# Altium schematic sheet Buffer.SchDoc: fNIRS - Buffer
size A4; CompanyName: UofT Capstone Team 2024991; Revision: 1; SheetNumber: 10; SheetTotal: 13
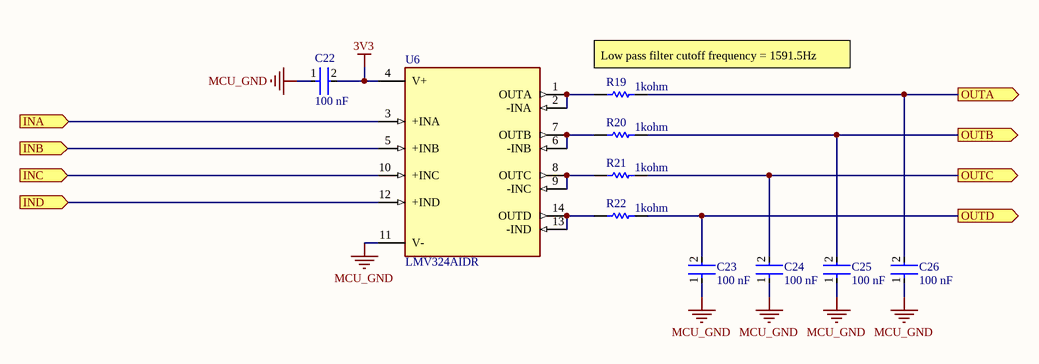
[diagram p0: Buffer.SchDoc]

## Parts
C22  Capacitance: 100 nF  [FP-CC0603-DA-MFG]  (hidden comment: CC0603KRX7R7BB104)
C23  Capacitance: 100 nF  [FP-CC0603-DA-MFG]  (hidden comment: CC0603KRX7R7BB104)
C24  Capacitance: 100 nF  [FP-CC0603-DA-MFG]  (hidden comment: CC0603KRX7R7BB104)
C25  Capacitance: 100 nF  [FP-CC0603-DA-MFG]  (hidden comment: CC0603KRX7R7BB104)
C26  Capacitance: 100 nF  [FP-CC0603-DA-MFG]  (hidden comment: CC0603KRX7R7BB104)
R19  Resistance: 1kohm  [RESC1608X55X25ML10T15]  (hidden comment: RC0603JR-071KL)
R20  Resistance: 1kohm  [RESC1608X55X25ML10T15]  (hidden comment: RC0603JR-071KL)
R21  Resistance: 1kohm  [RESC1608X55X25ML10T15]  (hidden comment: RC0603JR-071KL)
R22  Resistance: 1kohm  [RESC1608X55X25ML10T15]  (hidden comment: RC0603JR-071KL)
U6  LMV324AIDR  [SOIC127P600X175-14N]

## Ports
INA (in, see Sensing[6B]), INB (in, see Sensing[6B]), INC (in, see Sensing[6B]), IND (in, see Sensing[6B]), OUTA (out, see Sensing[6B]), OUTB (out, see Sensing[6B]), OUTC (out, see Sensing[6B]), OUTD (out, see Sensing[6B])

## Nets
3V3: C22.2 U6.4(V+)
MCU_GND: C22.1 C23.1 C24.1 C25.1 C26.1 U6.11(V-)
INA: U6.3(+INA) ; port INA
INB: U6.5(+INB) ; port INB
INC: U6.10(+INC) ; port INC
IND: U6.12(+IND) ; port IND
OUTA: C26.2 R19.2 ; port OUTA
OUTB: C25.2 R20.2 ; port OUTB
OUTC: C24.2 R21.2 ; port OUTC
OUTD: C23.2 R22.2 ; port OUTD
NetR19_1: R19.1 U6.1(OUTA) U6.2(-INA)
NetR20_1: R20.1 U6.6(-INB) U6.7(OUTB)
NetR21_1: R21.1 U6.8(OUTC) U6.9(-INC)
NetR22_1: R22.1 U6.13(-IND) U6.14(OUTD)

## Notes on the sheet
- (near R19) Low pass filter cutoff frequency = 1591.5Hz

## Library data of the parts
C22-C26 = CMP-2000-05002-2: CAP CER 0.1UF 16V X7R 0603; Manufacturer: YAGEO; Tolerance: 0.1; Value: 100 nF; Temperature Coefficient: 15%; Material: Ceramic; Voltage Rating: 16 V; Package: CC0603-DA; ComponentLink2Description: Datasheet; Octopart: https://octopart.com/cc0603krx7r7bb104-yageo-192941; Temperature Range High: +125°C; Digikey Description: CAP CER 0.1UF 16V X7R 0603; Voltage: 16 V; Device Class L2: Capacitors; Height: 0.9mm; Temperature: -55°C to +125°C; Manufacturer Part Number: CC0603KRX7R7BB104; Device Class L1: Passive Components; Device Class L3: Ceramic Capacitors; ComponentLink2URL: http://www.yageo.com/documents/recent/UPY-GPHC_X7R_6.3V-to-50V_18.pdf; Footprint Url: http://www.yageo.com/exep/pages/download/literatures/UPY-C_GEN_24.pdf; RoHS: TRUE; Temperature Range Low: -55°C; Temperature Characteristic: X7R; Lead Free: Yes; Category: Cap; Mouser Description: Multilayer Ceramic Capacitor, CC Series, 0.1 - F, - 10%, X7R, 16 V, 0603 [1608 Metric]; Automotive: No
R19-R22 = CMP-2000-05023-1: Chip Resistor, 1 KOhm, +/- 5%, 0.063 W, -55 to 155 degC, 0603 (1608 Metric), RoHS, Tape and Reel; Manufacturer: Yageo; Resistor Case Style: 0603[1608Metric]; Resistor Element Type: ThickFilm; Product Range: RCSeries; SVHC: ToBeAdvised; Voltage Rating: 50V; Temperature Coefficient: ±100ppm/degC; Power Rating: 100mW; Packaging: CutTape; Manufacturer URL: http://www.yageo.com/; Resistance Tolerance: ±5%; Datasheet Version: Rev. 4, 04/2009; MSL: MSL1-Unlimited; Package Description: 2-Pin Surface Mount Device, Body 1.6 x 0.8 mm; Automotive Qualification Standard: -; Package Reference: 603; Datasheet URL: https://datasheet.ciiva.com/2452/pyu-rc0603-51-rohs-l-4-2452848.pdf
U6 = LMV324AIDR: LMV324A, Quad Low-Voltage Rail-to-Rail Output Operational Amplifier 14-SOIC -40 to 125; MF: Texas Instruments; Package: SOIC-14 Texas Instruments; Price: None; MP: LMV324AIDR; Availability: Warning; Value: *; Texas_Instruments-Purchase-URL: https://snapeda.com/shop?store=Texas+Instruments&id=3658521; Mouser-Purchase-URL: https://snapeda.com/shop?store=Mouser&id=3658521; SnapEDA_Link: https://www.snapeda.com/parts/LMV324AIDR/Texas%20Instruments/view-part/3658521/?ref=snap